# EAGLE design pressure_regulator_8ch (EAGLE 9.6.2)
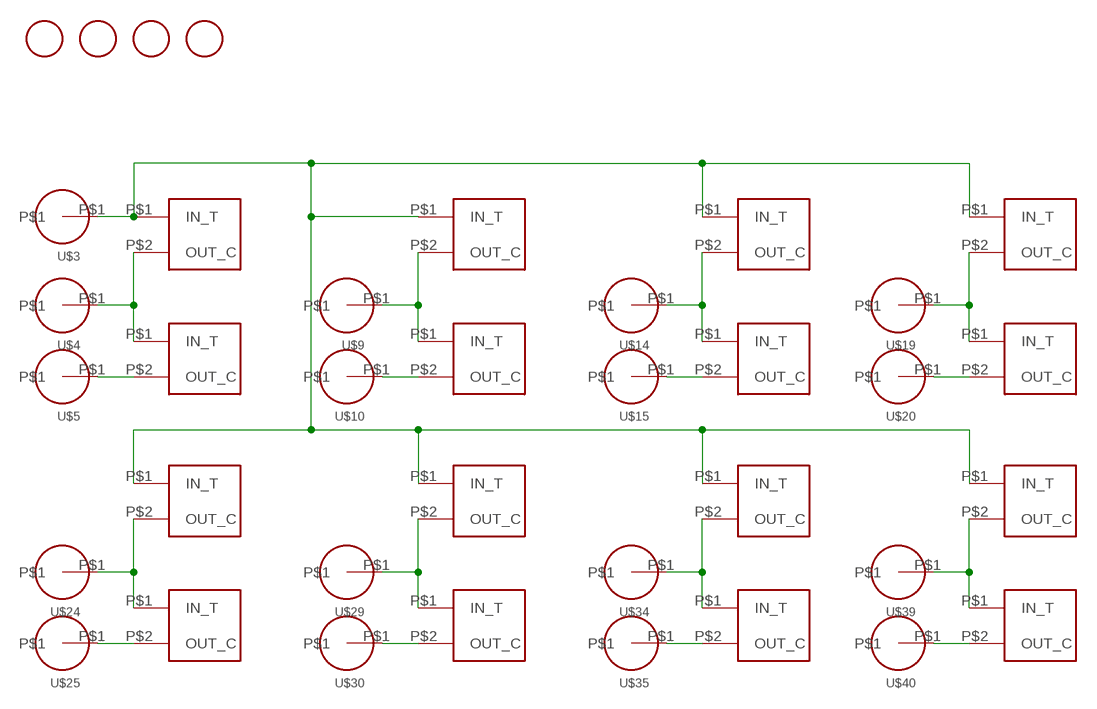
[diagram p0: schematic, sheet 1]

## Parts
U$1  PARKER_PROP_VALVE  [PARKER_PROP_VALVE]
U$2  PARKER_PROP_VALVE  [PARKER_PROP_VALVE]
U$3  10-32_BARBED_CONNECTOR  [10-32_BARBED_CONNECTOR]
U$4  10-32_BARBED_CONNECTOR  [10-32_BARBED_CONNECTOR]
U$5  10-32_BARBED_CONNECTOR  [10-32_BARBED_CONNECTOR]
U$6  PARKER_PROP_VALVE  [PARKER_PROP_VALVE]
U$7  PARKER_PROP_VALVE  [PARKER_PROP_VALVE]
U$9  10-32_BARBED_CONNECTOR  [10-32_BARBED_CONNECTOR]
U$10  10-32_BARBED_CONNECTOR  [10-32_BARBED_CONNECTOR]
U$11  PARKER_PROP_VALVE  [PARKER_PROP_VALVE]
U$12  PARKER_PROP_VALVE  [PARKER_PROP_VALVE]
U$14  10-32_BARBED_CONNECTOR  [10-32_BARBED_CONNECTOR]
U$15  10-32_BARBED_CONNECTOR  [10-32_BARBED_CONNECTOR]
U$16  PARKER_PROP_VALVE  [PARKER_PROP_VALVE]
U$17  PARKER_PROP_VALVE  [PARKER_PROP_VALVE]
U$19  10-32_BARBED_CONNECTOR  [10-32_BARBED_CONNECTOR]
U$20  10-32_BARBED_CONNECTOR  [10-32_BARBED_CONNECTOR]
U$21  PARKER_PROP_VALVE  [PARKER_PROP_VALVE]
U$22  PARKER_PROP_VALVE  [PARKER_PROP_VALVE]
U$24  10-32_BARBED_CONNECTOR  [10-32_BARBED_CONNECTOR]
U$25  10-32_BARBED_CONNECTOR  [10-32_BARBED_CONNECTOR]
U$26  PARKER_PROP_VALVE  [PARKER_PROP_VALVE]
U$27  PARKER_PROP_VALVE  [PARKER_PROP_VALVE]
U$29  10-32_BARBED_CONNECTOR  [10-32_BARBED_CONNECTOR]
U$30  10-32_BARBED_CONNECTOR  [10-32_BARBED_CONNECTOR]
U$31  PARKER_PROP_VALVE  [PARKER_PROP_VALVE]
U$32  PARKER_PROP_VALVE  [PARKER_PROP_VALVE]
U$34  10-32_BARBED_CONNECTOR  [10-32_BARBED_CONNECTOR]
U$35  10-32_BARBED_CONNECTOR  [10-32_BARBED_CONNECTOR]
U$36  PARKER_PROP_VALVE  [PARKER_PROP_VALVE]
U$37  PARKER_PROP_VALVE  [PARKER_PROP_VALVE]
U$39  10-32_BARBED_CONNECTOR  [10-32_BARBED_CONNECTOR]
U$40  10-32_BARBED_CONNECTOR  [10-32_BARBED_CONNECTOR]
U$50  M4  [M4]
U$51  M4  [M4]
U$52  M4  [M4]
U$53  M4  [M4]

## Nets
N$1: U$2.P$2(OUT_C) U$5.P$1
N$2: U$1.P$2(OUT_C) U$2.P$1(IN_T) U$4.P$1
N$3: U$1.P$1(IN_T) U$3.P$1 U$6.P$1(IN_T) U$11.P$1(IN_T) U$16.P$1(IN_T) U$21.P$1(IN_T) U$26.P$1(IN_T) U$31.P$1(IN_T) U$36.P$1(IN_T)
N$4: U$7.P$2(OUT_C) U$10.P$1
N$5: U$6.P$2(OUT_C) U$7.P$1(IN_T) U$9.P$1
N$7: U$12.P$2(OUT_C) U$15.P$1
N$8: U$11.P$2(OUT_C) U$12.P$1(IN_T) U$14.P$1
N$10: U$17.P$2(OUT_C) U$20.P$1
N$11: U$16.P$2(OUT_C) U$17.P$1(IN_T) U$19.P$1
N$13: U$22.P$2(OUT_C) U$25.P$1
N$14: U$21.P$2(OUT_C) U$22.P$1(IN_T) U$24.P$1
N$16: U$27.P$2(OUT_C) U$30.P$1
N$17: U$26.P$2(OUT_C) U$27.P$1(IN_T) U$29.P$1
N$19: U$32.P$2(OUT_C) U$35.P$1
N$20: U$31.P$2(OUT_C) U$32.P$1(IN_T) U$34.P$1
N$22: U$37.P$2(OUT_C) U$40.P$1
N$23: U$36.P$2(OUT_C) U$37.P$1(IN_T) U$39.P$1

## Library data of the parts
U$1 U$2 U$6 U$7 U$11 U$12 U$16 U$17 U$21 U$22 U$26 U$27 U$31 U$32 U$36 U$37 = Millfluidics_Library:PARKER_PROP_VALVE: Proportional valve manifold
U$3-U$5 U$9 U$10 U$14 U$15 U$19 U$20 U$24 U$25 U$29 U$30 U$34 U$35 U$39 U$40 = Millfluidics_Library:10-32_BARBED_CONNECTOR
U$50-U$53 = Millfluidics_Library:M4

## Board
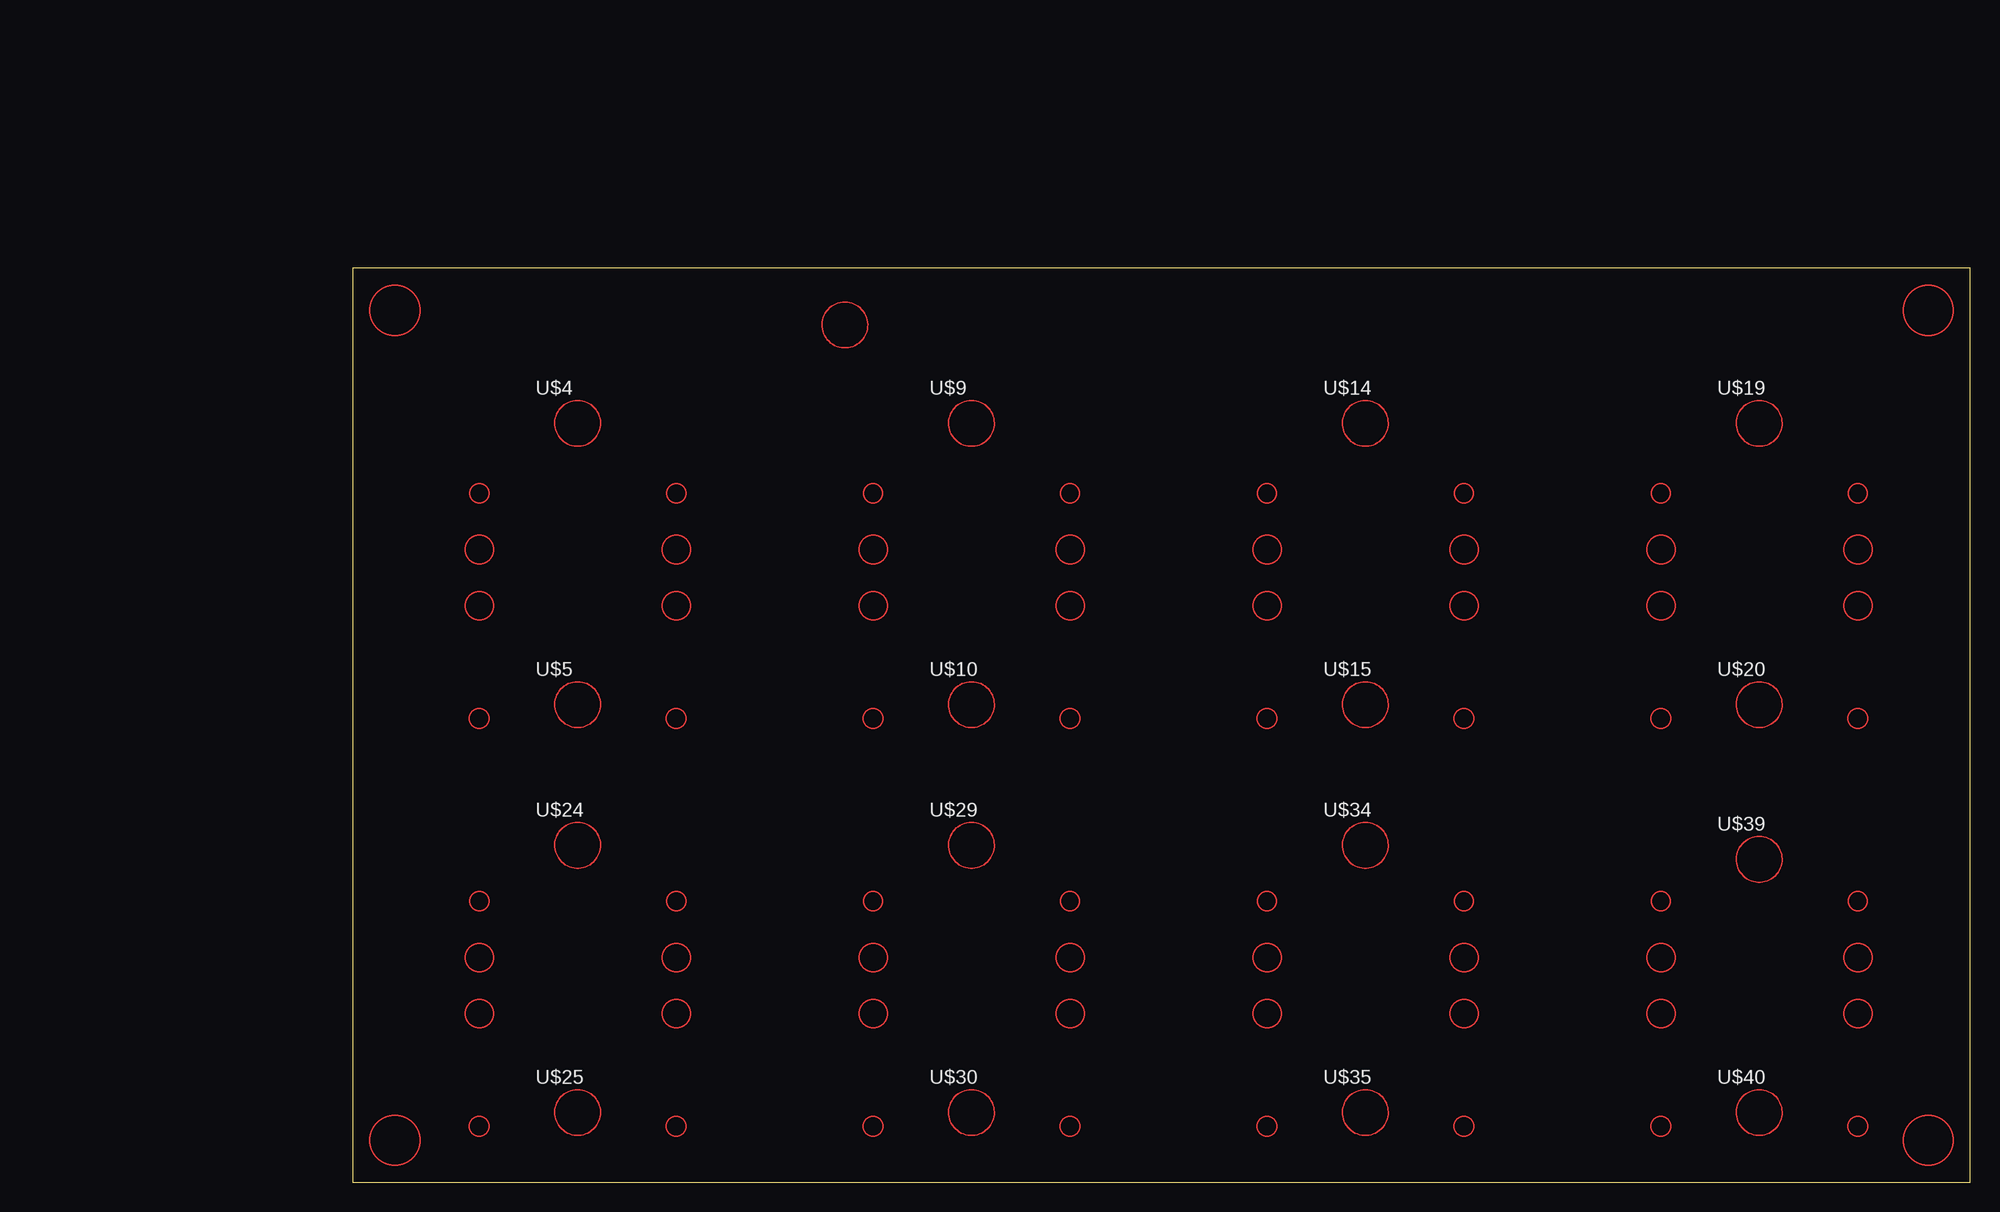
[diagram p1: board, top side]
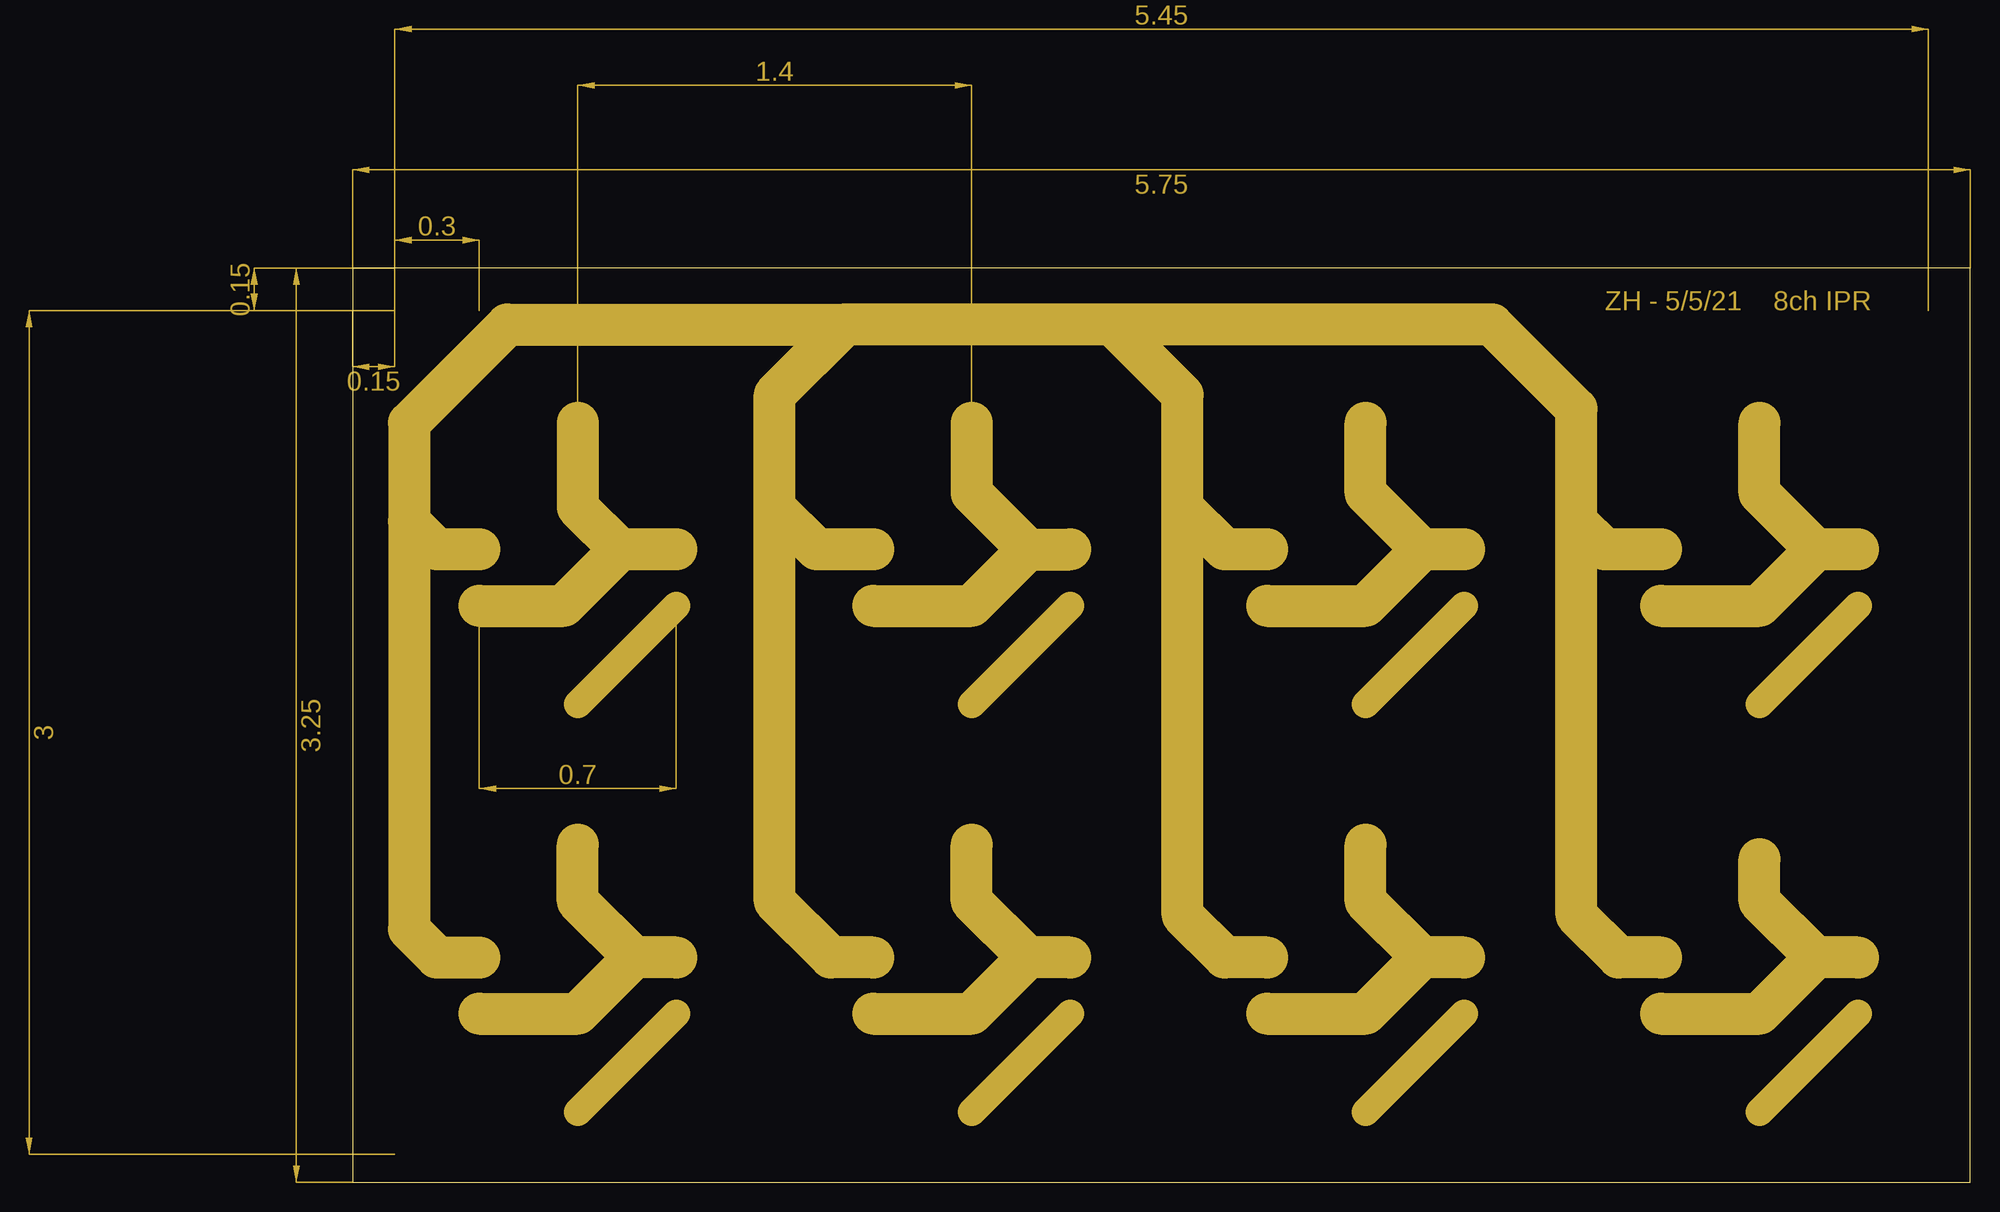
[diagram p2: board, inner layer L2-S1R]

Size 146.05 x 82.55 mm. Coordinates in mm from the lower left corner, seen from the top.
Outline: 0,0 146.05,0 146.05,82.55 0,82.55 0,0
Copper layers (1*2*3*4)*(5*6*7*8)*(9*10*11*12)*(13*14*15*16): L1-S1T 0.035mm / dielectric 0.15mm / L2-S1R 0.035mm / dielectric 0.15mm / L3-S1R 0.035mm / dielectric 0.2mm / L4-S1B 0.035mm / dielectric 0.15mm / L5-S2T 0.035mm / dielectric 0.2mm / L6-S2R 0.035mm / dielectric 0.15mm / L7-S2R 0.035mm / dielectric 0.2mm / L8-S2B 0.035mm / dielectric 0.15mm / L9-S3T 0.035mm / dielectric 0.2mm / L10-S3R 0.035mm / dielectric 0.15mm / L11-S3R 0.035mm / dielectric 0.2mm / L12-S3B 0.035mm / dielectric 0.15mm / L13-S4T 0.035mm / dielectric 0.2mm / L13-S4R 0.035mm / dielectric 0.15mm / L14-S4R 0.035mm / dielectric 0.2mm / L16-S4B 0.035mm
Design rules "default *": minimum track width 0.00011875mm, minimum drill 0.00011875mm, track to track 6mil, track to pad 6mil, pad to pad 6mil, via to via 6mil, smd to smd 6mil, copper to edge 40mil, drill to drill 6mil, minimum pad ring 0.00011875mm, minimum via ring 0.00011875mm, stop-mask expansion 4mil, vias tented up to drill 0mil, thermal gap 10mil

### Footprints (pad centres in the part's own frame; a part is rotated, then mirrored left to right if it is on the bottom)
PARKER_PROP_VALVE = drill 0 pad 0: P$1 0,5.08; P$2 0,0
10-32_BARBED_CONNECTOR = drill 0 pad 0: P$1 0,0

### Placement (x,y rotation side)
U$1  11.43,52.07 0 top
U$2  29.21,52.07 0 top
U$3  44.45,77.47 0 top
U$4  20.32,68.58 0 top
U$5  20.32,43.18 0 top
U$6  46.99,52.07 0 top
U$7  64.77,52.07 0 top
U$9  55.88,68.58 0 top
U$10  55.88,43.18 0 top
U$11  82.55,52.07 0 top
U$12  100.33,52.07 0 top
U$14  91.44,68.58 0 top
U$15  91.44,43.18 0 top
U$16  118.11,52.07 0 top
U$17  135.89,52.07 0 top
U$19  127,68.58 0 top
U$20  127,43.18 0 top
U$21  11.43,15.24 0 top
U$22  29.21,15.24 0 top
U$24  20.32,30.48 0 top
U$25  20.32,6.35 0 top
U$26  46.99,15.24 0 top
U$27  64.77,15.24 0 top
U$29  55.88,30.48 0 top
U$30  55.88,6.35 0 top
U$31  82.55,15.24 0 top
U$32  100.33,15.24 0 top
U$34  91.44,30.48 0 top
U$35  91.44,6.35 0 top
U$36  118.11,15.24 0 top
U$37  135.89,15.24 0 top
U$39  127,29.21 0 top
U$40  127,6.35 0 top
U$50  3.81,3.81 0 top
U$51  3.81,78.74 0 top
U$52  142.24,3.81 0 top
U$53  142.24,78.74 0 top

### Tracks (layer width: path | path; a pad name or v marks a point on that pad's centre or on a via)
N$1
  L2-S1R 2.54: U$5.P$1 U$2.P$2
N$2
  L2-S1R 3.81: U$2.P$1 24.13,57.15 | 24.13,57.15 20.32,60.96 U$4.P$1 | U$1.P$2 19.05,52.07 24.13,57.15
N$3
  L2-S1R 3.81: U$6.P$1 41.91,57.15 38.1,60.96 | U$1.P$1 7.62,57.15 5.08,59.69 | U$11.P$1 78.74,57.15 74.93,60.96 | 74.93,60.96 74.93,71.12 68.58,77.47 | U$16.P$1 113.03,57.15 110.49,59.69 | 110.49,59.69 110.49,69.85 102.87,77.47 68.58,77.47 | U$26.P$1 43.18,20.32 38.1,25.4 38.1,60.96 | U$31.P$1 78.74,20.32 74.93,24.13 74.93,60.96 | U$36.P$1 114.3,20.32 110.49,24.13 110.49,59.69 | 5.08,59.69 5.08,68.58 13.97,77.47 U$3.P$1 | 5.08,59.69 5.08,22.86 7.62,20.32 U$21.P$1 | 68.58,77.47 U$3.P$1 | 38.1,60.96 38.1,71.12 U$3.P$1
N$4
  L2-S1R 2.54: U$10.P$1 U$7.P$2
N$5
  L2-S1R 3.81: 60.96,57.15 U$7.P$1 | 60.96,57.15 55.88,62.23 U$9.P$1 | 60.96,57.15 55.88,52.07 U$6.P$2
N$7
  L2-S1R 2.54: U$15.P$1 U$12.P$2
N$8
  L2-S1R 3.81: U$12.P$1 96.52,57.15 | 96.52,57.15 91.44,62.23 U$14.P$1 | 96.52,57.15 91.44,52.07 U$11.P$2
N$10
  L2-S1R 2.54: U$20.P$1 U$17.P$2
N$11
  L2-S1R 3.81: U$17.P$1 132.08,57.15 | 132.08,57.15 127,62.23 U$19.P$1 | 132.08,57.15 127,52.07 U$16.P$2
N$13
  L2-S1R 2.54: U$25.P$1 U$22.P$2
N$14
  L2-S1R 3.81: U$22.P$1 25.4,20.32 | U$24.P$1 20.32,25.4 25.4,20.32 | 25.4,20.32 20.32,15.24 U$21.P$2
N$16
  L2-S1R 2.54: U$30.P$1 U$27.P$2
N$17
  L2-S1R 3.81: U$27.P$1 60.96,20.32 | U$29.P$1 55.88,25.4 60.96,20.32 | 60.96,20.32 55.88,15.24 U$26.P$2
N$19
  L2-S1R 2.54: U$35.P$1 U$32.P$2
N$20
  L2-S1R 3.81: U$32.P$1 96.52,20.32 | 96.52,20.32 91.44,25.4 U$34.P$1 | 96.52,20.32 91.44,15.24 U$31.P$2
N$22
  L2-S1R 2.54: U$40.P$1 U$37.P$2
N$23
  L2-S1R 3.81: U$37.P$1 132.08,20.32 | 132.08,20.32 127,25.4 U$39.P$1 | 132.08,20.32 127,15.24 U$36.P$2
(copper drawn outside any net)
  shapes: L2-S1R area x9

### Text on the board
L2-S1R: ZH - 5/5/21 | 8ch IPR